# Altium schematic sheet mounting_circuit(2).SchDoc
size A4; SheetNumber: 3; SheetTotal: 5
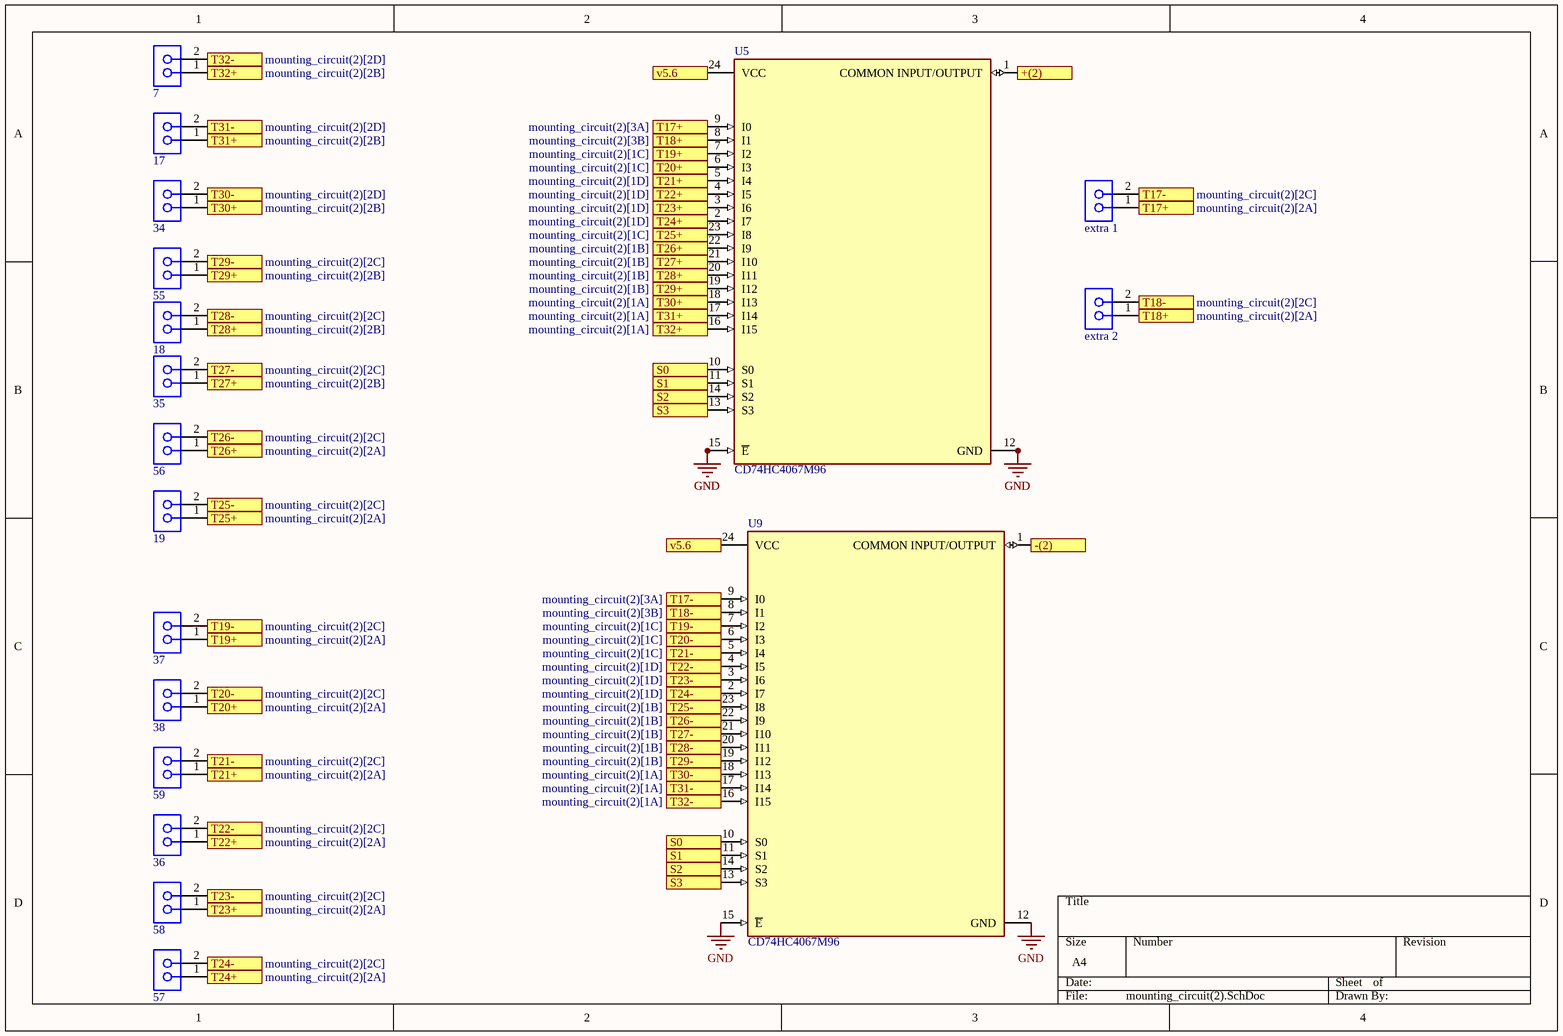
[diagram p0: mounting_circuit(2).SchDoc]

## Parts
7  Comment  [SMTC-SSW-102-02-X-S]  (value not drawn)
17  Comment  [SMTC-SSW-102-02-X-S]  (value not drawn)
18  0  [SMTC-SSW-102-02-X-S]  (value not drawn)
19  Comment  [SMTC-SSW-102-02-X-S]  (value not drawn)
34  Comment  [SMTC-SSW-102-02-X-S]  (value not drawn)
35  Comment  [SMTC-SSW-102-02-X-S]  (value not drawn)
36  Comment  [SMTC-SSW-102-02-X-S]  (value not drawn)
37  Comment  [SMTC-SSW-102-02-X-S]  (value not drawn)
38  1  [SMTC-SSW-102-02-X-S]  (value not drawn)
55  0  [SMTC-SSW-102-02-X-S]  (value not drawn)
56  Comment  [SMTC-SSW-102-02-X-S]  (value not drawn)
57  Comment  [SMTC-SSW-102-02-X-S]  (value not drawn)
58  Comment  [SMTC-SSW-102-02-X-S]  (value not drawn)
59  Comment  [SMTC-SSW-102-02-X-S]  (value not drawn)
extra_1  Comment  [SMTC-SSW-102-02-X-S]  (value not drawn)
extra_2  Comment  [SMTC-SSW-102-02-X-S]  (value not drawn)
U5  CD74HC4067M96  [FP-DW0024A-MFG]
U9  CD74HC4067M96  [FP-DW0024A-MFG]

## Ports
+(2), -(2), S0 (see mounting_circuit(2)[2B], mounting_circuit(3)[2B], mounting_circuit(3)[2D], mounting_circuit[3B], mounting_circuit[3D]), S0 (see mounting_circuit(2)[2D], mounting_circuit(3)[2B], mounting_circuit(3)[2D], mounting_circuit[3B], mounting_circuit[3D]), S1 (see mounting_circuit(2)[2B], mounting_circuit(3)[2B], mounting_circuit(3)[2D], mounting_circuit[3B], mounting_circuit[3D]), S1 (see mounting_circuit(2)[2D], mounting_circuit(3)[2B], mounting_circuit(3)[2D], mounting_circuit[3B], mounting_circuit[3D]), S2 (see mounting_circuit(2)[2B], mounting_circuit(3)[2B], mounting_circuit(3)[2D], mounting_circuit[3B], mounting_circuit[3D]), S2 (see mounting_circuit(2)[2D], mounting_circuit(3)[2B], mounting_circuit(3)[2D], mounting_circuit[3B], mounting_circuit[3D]), S3 (see mounting_circuit(2)[2B], mounting_circuit(3)[2B], mounting_circuit(3)[2D], mounting_circuit[3B], mounting_circuit[3D]), S3 (see mounting_circuit(2)[2D], mounting_circuit(3)[2B], mounting_circuit(3)[2D], mounting_circuit[3B], mounting_circuit[3D]), T17+ (see mounting_circuit(2)[2A]), T17+ (see mounting_circuit(2)[3A]), T17- (see mounting_circuit(2)[2C]), T17- (see mounting_circuit(2)[3A]), T18+ (see mounting_circuit(2)[2A]), T18+ (see mounting_circuit(2)[3B]), T18- (see mounting_circuit(2)[2C]), T18- (see mounting_circuit(2)[3B]), T19+ (see mounting_circuit(2)[1C]), T19+ (see mounting_circuit(2)[2A]), T19- (see mounting_circuit(2)[1C]), T19- (see mounting_circuit(2)[2C]), T20+ (see mounting_circuit(2)[1C]), T20+ (see mounting_circuit(2)[2A]), T20- (see mounting_circuit(2)[1C]), T20- (see mounting_circuit(2)[2C]), T21+ (see mounting_circuit(2)[1D]), T21+ (see mounting_circuit(2)[2A]), T21- (see mounting_circuit(2)[1C]), T21- (see mounting_circuit(2)[2C]), T22+ (see mounting_circuit(2)[1D]), T22+ (see mounting_circuit(2)[2A]), T22- (see mounting_circuit(2)[1D]), T22- (see mounting_circuit(2)[2C]), T23+ (see mounting_circuit(2)[1D]), T23+ (see mounting_circuit(2)[2A]), T23- (see mounting_circuit(2)[1D]), T23- (see mounting_circuit(2)[2C]), T24+ (see mounting_circuit(2)[1D]), T24+ (see mounting_circuit(2)[2A]), T24- (see mounting_circuit(2)[1D]), T24- (see mounting_circuit(2)[2C]), T25+ (see mounting_circuit(2)[1C]), T25+ (see mounting_circuit(2)[2A]), T25- (see mounting_circuit(2)[1B]), T25- (see mounting_circuit(2)[2C]), T26+ (see mounting_circuit(2)[1B]), T26+ (see mounting_circuit(2)[2A]), T26- (see mounting_circuit(2)[1B]), T26- (see mounting_circuit(2)[2C]), T27+ (see mounting_circuit(2)[1B]), T27+ (see mounting_circuit(2)[2B]), T27- (see mounting_circuit(2)[1B]), T27- (see mounting_circuit(2)[2C]), T28+ (see mounting_circuit(2)[1B]), T28+ (see mounting_circuit(2)[2B]), T28- (see mounting_circuit(2)[1B]), T28- (see mounting_circuit(2)[2C]), T29+ (see mounting_circuit(2)[1B]), T29+ (see mounting_circuit(2)[2B]), T29- (see mounting_circuit(2)[1B]), T29- (see mounting_circuit(2)[2C]), T30+ (see mounting_circuit(2)[1A]), T30+ (see mounting_circuit(2)[2B]), T30- (see mounting_circuit(2)[1A]), T30- (see mounting_circuit(2)[2D]), T31+ (see mounting_circuit(2)[1A]), T31+ (see mounting_circuit(2)[2B]), T31- (see mounting_circuit(2)[1A]), T31- (see mounting_circuit(2)[2D]), T32+ (see mounting_circuit(2)[1A]), T32+ (see mounting_circuit(2)[2B]), T32- (see mounting_circuit(2)[1A]), T32- (see mounting_circuit(2)[2D]), v5.6 (see mounting_circuit(2)[2A], mounting_circuit(3)[2A], mounting_circuit(3)[2C], mounting_circuit(4)[2A], mounting_circuit(4)[2C], mounting_circuit[1A], mounting_circuit[3A], mounting_circuit[3B]), v5.6 (see mounting_circuit(2)[2C], mounting_circuit(3)[2A], mounting_circuit(3)[2C], mounting_circuit(4)[2A], mounting_circuit(4)[2C], mounting_circuit[1A], mounting_circuit[3A], mounting_circuit[3B])

## Nets
GND: U5.12(GND) U5.15(~{E}) U9.12(GND) U9.15(~{E})
+(2): U5.1(COMMON_INPUT/OUTPUT) ; port +(2)
-(2): U9.1(COMMON_INPUT/OUTPUT) ; port -(2)
S0: U5.10(S0) U9.10(S0) ; port S0
S1: U5.11(S1) U9.11(S1) ; port S1
S2: U5.14(S2) U9.14(S2) ; port S2
S3: U5.13(S3) U9.13(S3) ; port S3
T17+: extra_1.1 U5.9(I0) ; port T17+
T17-: extra_1.2 U9.9(I0) ; port T17-
T18+: extra_2.1 U5.8(I1) ; port T18+
T18-: extra_2.2 U9.8(I1) ; port T18-
T19+: 37.1 U5.7(I2) ; port T19+
T19-: 37.2 U9.7(I2) ; port T19-
T20+: 38.1 U5.6(I3) ; port T20+
T20-: 38.2 U9.6(I3) ; port T20-
T21+: 59.1 U5.5(I4) ; port T21+
T21-: 59.2 U9.5(I4) ; port T21-
T22+: 36.1 U5.4(I5) ; port T22+
T22-: 36.2 U9.4(I5) ; port T22-
T23+: 58.1 U5.3(I6) ; port T23+
T23-: 58.2 U9.3(I6) ; port T23-
T24+: 57.1 U5.2(I7) ; port T24+
T24-: 57.2 U9.2(I7) ; port T24-
T25+: 19.1 U5.23(I8) ; port T25+
T25-: 19.2 U9.23(I8) ; port T25-
T26+: 56.1 U5.22(I9) ; port T26+
T26-: 56.2 U9.22(I9) ; port T26-
T27+: 35.1 U5.21(I10) ; port T27+
T27-: 35.2 U9.21(I10) ; port T27-
T28+: 18.1 U5.20(I11) ; port T28+
T28-: 18.2 U9.20(I11) ; port T28-
T29+: 55.1 U5.19(I12) ; port T29+
T29-: 55.2 U9.19(I12) ; port T29-
T30+: 34.1 U5.18(I13) ; port T30+
T30-: 34.2 U9.18(I13) ; port T30-
T31+: 17.1 U5.17(I14) ; port T31+
T31-: 17.2 U9.17(I14) ; port T31-
T32+: 7.1 U5.16(I15) ; port T32+
T32-: 7.2 U9.16(I15) ; port T32-
v5.6: U5.24(VCC) U9.24(VCC) ; port v5.6

## Library data of the parts
7 17-19 34-38 55-59 extra_1 extra_2 = CMP-1023-00323-1: SQ Post Socket, Through-hole, Vertical, -55 to 105 degC, 2.54 mm Pitch, 2-Pin, Female, RoHS; Manufacturer: Samtec; PartNumber: SSW-102-02-T-S; Pitch: 2.54 mm; ComponentLink3Description: Package Specification; ComponentLink2Description: Datasheet; ComponentLink1Description: Manufacturer URL; PackageVersion: CA, 6/1987; DatasheetVersion: F-214; PackageDescription: Assembly, Socket Strip .016 X .031 Tail; ComponentLink2URL: http://www.samtec.com/documents/webfiles/pdf/SSW_TH.PDF; RoHS: True; ComponentLink3URL: http://www.samtec.com/documents/webfiles/cpdf/SSW-1XX-XX-XXX-X-XX-XXX-XX-MKT.pdf; ComponentLink1URL: http://www.samtec.com; PackageReference: SSW-102-02-X-S; Mounting Technology: Through-hole; Orientation: Vertical; Temperature Range: -55 to 105 degC
U5 U9 = CMP-04901-000007-1: IC MUX/DEMUX 1X16 24SOIC; Manufacturer: Texas Instruments; Standoff Height: 0.1mm; Logic Function Desc: Non-Inverting; Max Supply Voltage: 6V; Number Of Inputs: 16; Quiescent Current: 8uA; Number Of Circuits: 1; Propagation Delay: 6ns; Max Junction Temp: +150°C; Min Supply Voltage: 2V; ComponentLink2Description: Datasheet; Octopart: https://octopart.com/cd74hc4067m96-texas+instruments-722802; Ambient Temperature Range High: +125°C; Ipc Land Pattern Name: SOIC127P1030X265-24; Height: 2.65mm; Mouser Description: Multiplexer Switch ICs Hi-Spd CMOS 16Ch Anl Mltplxr/Demltplxr; Temperature Range Low: -55°C; Package: DW0024A; Temperature Range High: +125°C; Lead Free: Yes; ComponentLink2URL: http://www.ti.com/lit/ds/symlink/cd74hc4067.pdf; Manufacturer Part Number: CD74HC4067M96; RoHS: TRUE; Automotive: No; Device Class L1: Integrated Circuits (ICs); Digikey Description: IC MUX/DEMUX 1X16 24SOIC; Device Class L2: Logic ICs; Temperature: -55°C to +125°C; Device Class L3: Multiplexers; Category: IC; Ambient Temperature Range Low: -55°C; Number Of Outputs: 1